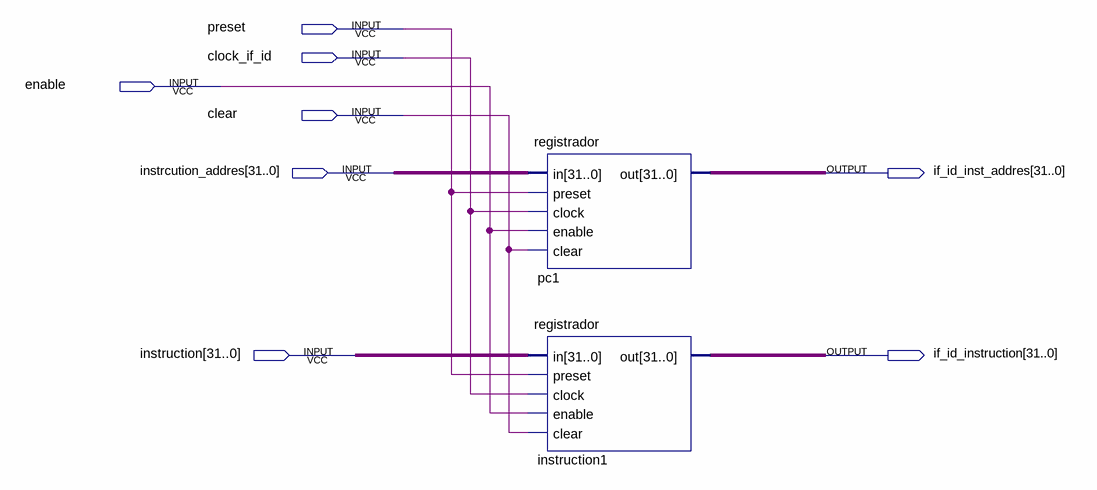
[diagram p0: schematic sheet]
// Quartus schematic IFID.bdf as structural Verilog: 2 symbols, 8 pins
module IFID (
  input  preset,
  input  clock_if_id,
  input  enable,
  input  clear,
  input  [31:0] instrcution_addres,
  input  [31:0] instruction,
  output [31:0] if_id_inst_addres,
  output [31:0] if_id_instruction
);

  registrador pc1 (
    .in(instrcution_addres), .preset(preset), .clock(clock_if_id), .enable(enable), .clear(clear),
    .out(if_id_inst_addres));
  registrador instruction1 (
    .in(instruction), .preset(preset), .clock(clock_if_id), .enable(enable), .clear(clear),
    .out(if_id_instruction));
endmodule
